# Altium schematic sheet ZOWI_LED_Matrix.SchDoc: ZOWI LED Matrix
size A4; Author: Jon Goitia; CompanyName: bq - Mundo Reader; Organization: bq - Mundo Reader; DocumentNumber: 1; Revision: 0; SheetNumber: 1; SheetTotal: 1
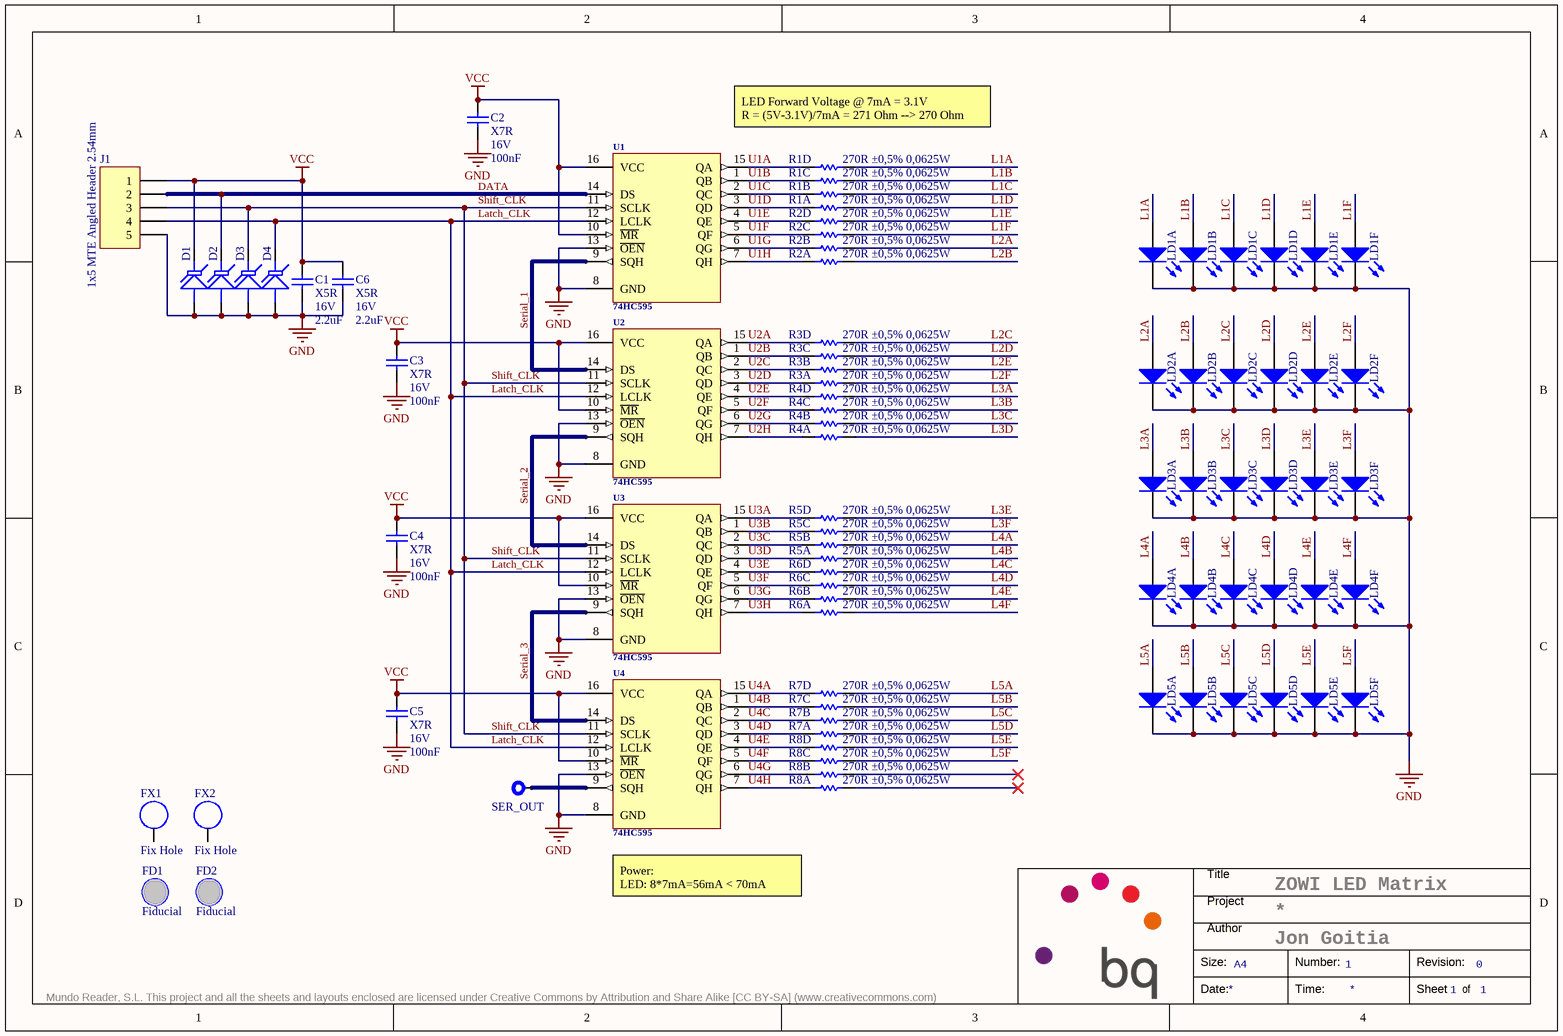
[diagram p0: ZOWI_LED_Matrix.SchDoc]

## Parts
C1  Dielectric: X5R  Voltage: 16V  Capacitance: 2.2uF  [C0603]  (hidden comment: Capacitor)
C2  Dielectric: X7R  Voltage: 16V  Capacitance: 100nF  [C0402]  (hidden comment: Capacitor)
C3  Dielectric: X7R  Voltage: 16V  Capacitance: 100nF  [C0402]  (hidden comment: Capacitor)
C4  Dielectric: X7R  Voltage: 16V  Capacitance: 100nF  [C0402]  (hidden comment: Capacitor)
C5  Dielectric: X7R  Voltage: 16V  Capacitance: 100nF  [C0402]  (hidden comment: Capacitor)
C6  Dielectric: X5R  Voltage: 16V  Capacitance: 2.2uF  [C0603]  (hidden comment: Capacitor)
D1  ESD9L5.0ST5G  [SOD923]  (value not drawn)
D2  ESD9L5.0ST5G  [SOD923]  (value not drawn)
D3  ESD9L5.0ST5G  [SOD923]  (value not drawn)
D4  ESD9L5.0ST5G  [SOD923]  (value not drawn)
FD1  Fiducial  [Fiducial_1mm]  (no BOM)
FD2  Fiducial  [Fiducial_1mm]  (no BOM)
FX1  Fix Hole  [Fix_Hole_3.2mm]  (no BOM)
FX2  Fix Hole  [Fix_Hole_3.2mm]  (no BOM)
J1  1x5 MTE Angled Header 2.54mm  [1x5 MTE Angled Header 2.54mm]
LD1A  White  [LED0805]  (value not drawn)
LD1B  White  [LED0805]  (value not drawn)
LD1C  White  [LED0805]  (value not drawn)
LD1D  White  [LED0805]  (value not drawn)
LD1E  White  [LED0805]  (value not drawn)
LD1F  White  [LED0805]  (value not drawn)
LD2A  White  [LED0805]  (value not drawn)
LD2B  White  [LED0805]  (value not drawn)
LD2C  White  [LED0805]  (value not drawn)
LD2D  White  [LED0805]  (value not drawn)
LD2E  White  [LED0805]  (value not drawn)
LD2F  White  [LED0805]  (value not drawn)
LD3A  White  [LED0805]  (value not drawn)
LD3B  White  [LED0805]  (value not drawn)
LD3C  White  [LED0805]  (value not drawn)
LD3D  White  [LED0805]  (value not drawn)
LD3E  White  [LED0805]  (value not drawn)
LD3F  White  [LED0805]  (value not drawn)
LD4A  White  [LED0805]  (value not drawn)
LD4B  White  [LED0805]  (value not drawn)
LD4C  White  [LED0805]  (value not drawn)
LD4D  White  [LED0805]  (value not drawn)
LD4E  White  [LED0805]  (value not drawn)
LD4F  White  [LED0805]  (value not drawn)
LD5A  White  [LED0805]  (value not drawn)
LD5B  White  [LED0805]  (value not drawn)
LD5C  White  [LED0805]  (value not drawn)
LD5D  White  [LED0805]  (value not drawn)
LD5E  White  [LED0805]  (value not drawn)
LD5F  White  [LED0805]  (value not drawn)
R1  value 270R ±0,5% 0,0625W  [4xArray_1206]  (hidden comment: Resistor_x4_Parts)  (parts A,B,C,D of 4)
R2  value 270R ±0,5% 0,0625W  [4xArray_1206]  (hidden comment: Resistor_x4_Parts)  (parts A,B,C,D of 4)
R3  value 270R ±0,5% 0,0625W  [4xArray_1206]  (hidden comment: Resistor_x4_Parts)  (parts A,B,C,D of 4)
R4  value 270R ±0,5% 0,0625W  [4xArray_1206]  (hidden comment: Resistor_x4_Parts)  (parts A,B,C,D of 4)
R5  value 270R ±0,5% 0,0625W  [4xArray_1206]  (hidden comment: Resistor_x4_Parts)  (parts A,B,C,D of 4)
R6  value 270R ±0,5% 0,0625W  [4xArray_1206]  (hidden comment: Resistor_x4_Parts)  (parts A,B,C,D of 4)
R7  value 270R ±0,5% 0,0625W  [4xArray_1206]  (hidden comment: Resistor_x4_Parts)  (parts A,B,C,D of 4)
R8  value 270R ±0,5% 0,0625W  [4xArray_1206]  (hidden comment: Resistor_x4_Parts)  (parts A,B,C,D of 4)
SER_OUT  Testpoint  [TP_POWER]  (value not drawn)  (no BOM)
U1  74HC595  [DHVQFN16-2.5x3.5MM]
U2  74HC595  [DHVQFN16-2.5x3.5MM]
U3  74HC595  [DHVQFN16-2.5x3.5MM]
U4  74HC595  [DHVQFN16-2.5x3.5MM]

## Nets
GND: C1.1 C2.1 C3.1 C4.1 C5.1 C6.1 D1.A D2.A D3.A D4.A J1.5 LD1A.K LD1B.K LD1C.K LD1D.K LD1E.K LD1F.K LD2A.K LD2B.K LD2C.K LD2D.K LD2E.K LD2F.K LD3A.K LD3B.K LD3C.K LD3D.K LD3E.K LD3F.K LD4A.K LD4B.K LD4C.K LD4D.K LD4E.K LD4F.K LD5A.K LD5B.K LD5C.K LD5D.K LD5E.K LD5F.K U1.8(GND) U1.13(~{OEN}) U2.8(GND) U2.13(~{OEN}) U3.8(GND) U3.13(~{OEN}) U4.8(GND) U4.13(~{OEN})
VCC: C1.2 C2.2 C3.2 C4.2 C5.2 C6.2 D1.K J1.1 U1.10(~{MR}) U1.16(VCC) U2.10(~{MR}) U2.16(VCC) U3.10(~{MR}) U3.16(VCC) U4.10(~{MR}) U4.16(VCC)
DATA: D2.K J1.2 U1.14(DS)
L1A: LD1A.A R1.5
L1B: LD1B.A R1.6
L1C: LD1C.A R1.7
L1D: LD1D.A R1.8
L1E: LD1E.A R2.5
L1F: LD1F.A R2.6
L2A: LD2A.A R2.7
L2B: LD2B.A R2.8
L2C: LD2C.A R3.5
L2D: LD2D.A R3.6
L2E: LD2E.A R3.7
L2F: LD2F.A R3.8
L3A: LD3A.A R4.5
L3B: LD3B.A R4.6
L3C: LD3C.A R4.7
L3D: LD3D.A R4.8
L3E: LD3E.A R5.5
L3F: LD3F.A R5.6
L4A: LD4A.A R5.7
L4B: LD4B.A R5.8
L4C: LD4C.A R6.5
L4D: LD4D.A R6.6
L4E: LD4E.A R6.7
L4F: LD4F.A R6.8
L5A: LD5A.A R7.5
L5B: LD5B.A R7.6
L5C: LD5C.A R7.7
L5D: LD5D.A R7.8
L5E: LD5E.A R8.5
L5F: LD5F.A R8.6
Latch_CLK: D4.K J1.4 U1.12(LCLK) U2.12(LCLK) U3.12(LCLK) U4.12(LCLK)
Serial_1: U1.9(SQH) U2.14(DS)
Serial_2: U2.9(SQH) U3.14(DS)
Serial_3: U3.9(SQH) U4.14(DS)
Shift_CLK: D3.K J1.3 U1.11(SCLK) U2.11(SCLK) U3.11(SCLK) U4.11(SCLK)
U1A: R1.4 U1.15(QA)
U1B: R1.3 U1.1(QB)
U1C: R1.2 U1.2(QC)
U1D: R1.1 U1.3(QD)
U1E: R2.4 U1.4(QE)
U1F: R2.3 U1.5(QF)
U1G: R2.2 U1.6(QG)
U1H: R2.1 U1.7(QH)
U2A: R3.4 U2.15(QA)
U2B: R3.3 U2.1(QB)
U2C: R3.2 U2.2(QC)
U2D: R3.1 U2.3(QD)
U2E: R4.4 U2.4(QE)
U2F: R4.3 U2.5(QF)
U2G: R4.2 U2.6(QG)
U2H: R4.1 U2.7(QH)
U3A: R5.4 U3.15(QA)
U3B: R5.3 U3.1(QB)
U3C: R5.2 U3.2(QC)
U3D: R5.1 U3.3(QD)
U3E: R6.4 U3.4(QE)
U3F: R6.3 U3.5(QF)
U3G: R6.2 U3.6(QG)
U3H: R6.1 U3.7(QH)
U4A: R7.4 U4.15(QA)
U4B: R7.3 U4.1(QB)
U4C: R7.2 U4.2(QC)
U4D: R7.1 U4.3(QD)
U4E: R8.4 U4.4(QE)
U4F: R8.3 U4.5(QF)
U4G: R8.2 U4.6(QG)
U4H: R8.1 U4.7(QH)
NetSER_OUT_1: SER_OUT.1 U4.9(SQH)

Not connected (* = marked no-connect by the designer): FX1 1; FX2 1; R8 7* 8*

## Notes on the sheet
- LED Forward Voltage @ 7mA = 3.1V
  R = (5V-3.1V)/7mA = 271 Ohm --> 270 Ohm
- (near U4) Power:
  LED: 8*7mA=56mA < 70mA
- Title
- Project
- Size:
- Author
- A4
- Number:
- Revision:
- Mundo Reader, S.L. This project and all the sheets and layouts enclosed are licensed under Creative Commons by Attribution and Share Alike [CC BY-SA] (www.creativecommons.com)
- Date:
- Time:
- Sheet
- of

## Library data of the parts
C1 C6 = C0603_2.2uF_16V_±10%: Capacitor SMD; Manufacturer: Kemet; Value: 2.2uF ±10% 16V; Tolerance: ±10%; OrderingCode: C0603C225K4PAC; Temp_ Max: 125; Temp_ Min: -55; Part Number: C0603_2.2uF_16V_±10%
C2-C5 = C0402_100nF_16V_±10%: Capacitor SMD; Manufacturer: Kemet; Value: 100nF ±10% 16V; Tolerance: ±10%; OrderingCode: C0402C104K4RAC; Temp_ Max: 125; Temp_ Min: -55; Part Number: C0402_100nF_16V_±10%
D1-D4 = TVS 5Vdc Low Cap: Protection, Transient Suppression Diode; Manufacturer: ON Semiconductor; Voltage: 5Vdc; Breakdown Voltage: 5,4Vdc; Overvoltage Current: 1A; Temp_ Max: 125; Temp_ Min: -55; Part Number: TVS 5Vdc Low Cap; OrderingCode: ESD9L5.0ST5G
FD1 FD2 = Fiducial 1mm: Fiducial Mark; Part Number: Fiducial 1mm
FX1 FX2 = FX_3.2: Part Number: FX_3.2
J1 = CON_MTE_Angled_HDR_THT2.54_5: Connector, 1x5 MTE Angled Header 2.54mm; Manufacturer: TE Connectivity; OrderingCode: 5-103635-4; Temp_ Max: 105; Temp_ Min: -65; Value: 5; Part Number: CON_MTE_Angled_HDR_THT2.54_5
LD1A LD1B LD1C LD1D LD1E LD1F LD2A LD2B LD2C LD2D LD2E LD2F LD3A LD3B LD3C LD3D LD3E LD3F LD4A LD4B LD4C LD4D LD4E LD4F LD5A LD5B LD5C LD5D LD5E LD5F = LTW-170ZDC: LED; Manufacturer: Lite-On; Temp_ Max: 80; Temp_ Min: -20; Part Number: LTW-170ZDC; OrderingCode: LTW-170ZDC; Value: White
R1-R8 = 4xArray_1206_270R_0,0625W_±0,5%: Resistor; Manufacturer: Bourns; Tolerance: ±0,5%; OrderingCode: CAY16-271J4LF; Resistance: 270R; Temp_ Max: 125; Temp_ Min: -55; PackageDescription: SMD; Power: 0,0625W; Part Number: 4xArray_1206_270R_0,0625W_±0,5%
SER_OUT = TP_POWER: Manufacturer: Oxley; OrderingCode: SMOX/060/B1; SAP: 303552; Part Number: TP_POWER
U1-U4 = 74HC595_QFN: Shift Register 8BIT; Manufacturer: NXP; OrderingCode: 74HC595BQ; Temp_ Max: 125; Temp_ Min: -40; Part Number: 74HC595_QFN